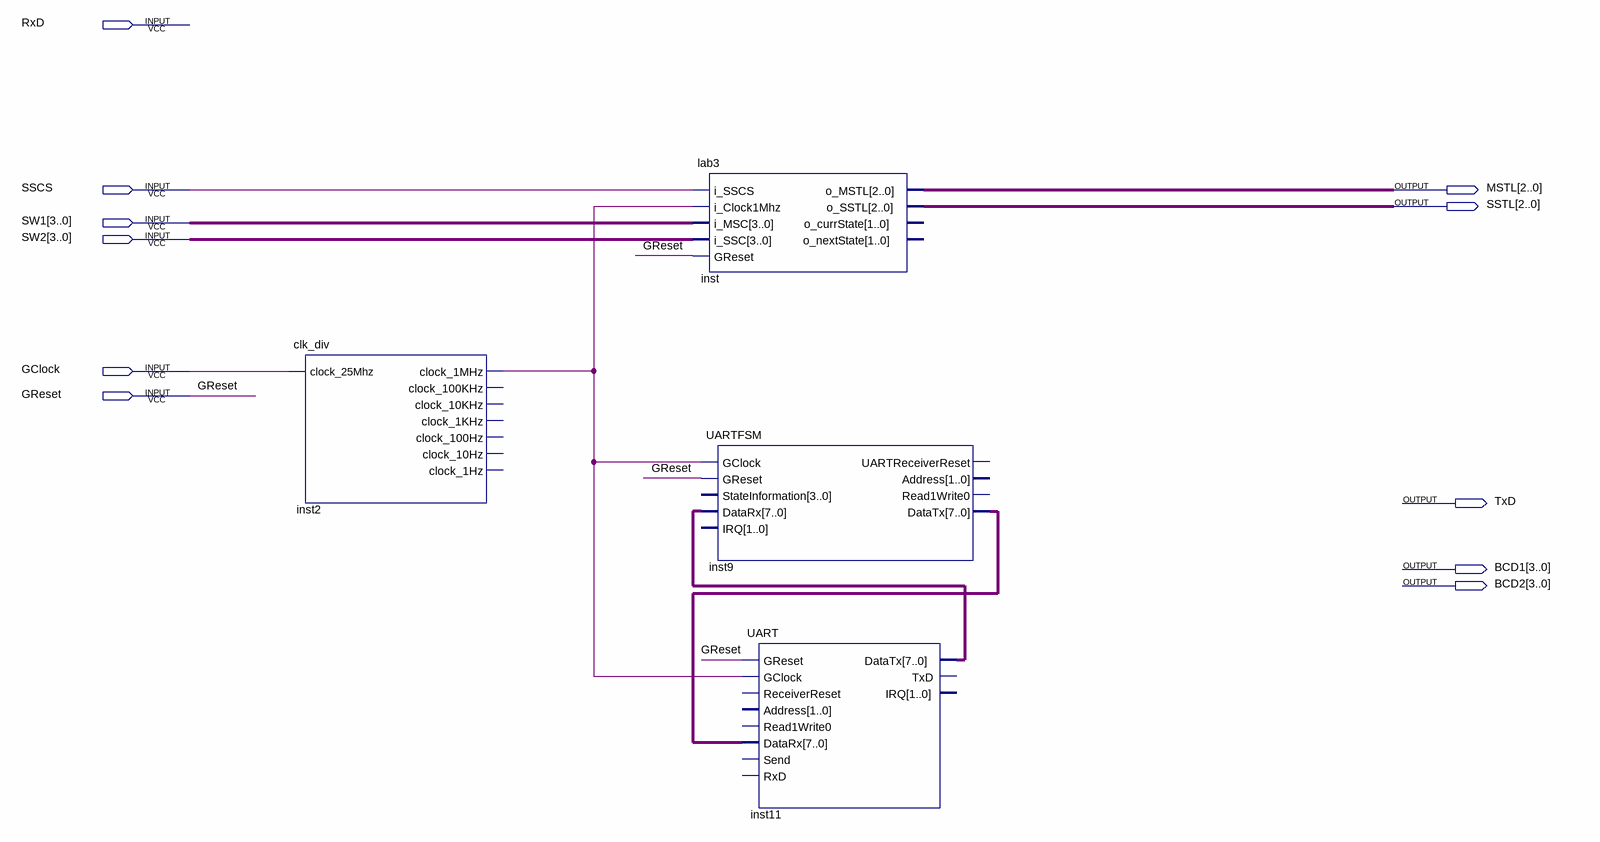
[diagram p0: schematic sheet]
// Quartus schematic toplevelProject.bdf as structural Verilog: 4 symbols, 11 pins
module toplevelProject (
  input  RxD,
  input  SSCS,
  input  [3:0] SW1,
  input  [3:0] SW2,
  input  GClock,
  input  GReset,
  output [2:0] MSTL,
  output [2:0] SSTL,
  output TxD,
  output [3:0] BCD1,
  output [3:0] BCD2
);

  wire inst2_clock_1mhz;
  wire [7:0] inst9_datatx, inst11_datatx;

  clk_div inst2 (
    .clock_25Mhz(GClock), .clock_1MHz(inst2_clock_1mhz));  // open: clock_100KHz, clock_10KHz, clock_1KHz, clock_100Hz, clock_10Hz, clock_1Hz
  lab3 inst (
    .i_SSCS(SSCS), .i_Clock1Mhz(inst2_clock_1mhz), .i_MSC(SW1), .i_SSC(SW2), .GReset(GReset), .o_MSTL(MSTL),
    .o_SSTL(SSTL));  // open: o_currState, o_nextState
  UARTFSM inst9 (
    .GClock(inst2_clock_1mhz), .GReset(GReset), .DataRx(inst11_datatx), .DataTx(inst9_datatx));  // open: StateInformation, IRQ, UARTReceiverReset, Address, Read1Write0
  UART inst11 (
    .GReset(GReset), .GClock(inst2_clock_1mhz), .DataRx(inst9_datatx), .DataTx(inst11_datatx));  // open: ReceiverReset, Address, Read1Write0, Send, RxD, TxD, IRQ
endmodule
